# EAGLE schematic Wallboxsteuerung-WEMOS-14062021 (EAGLE 7.5.0)
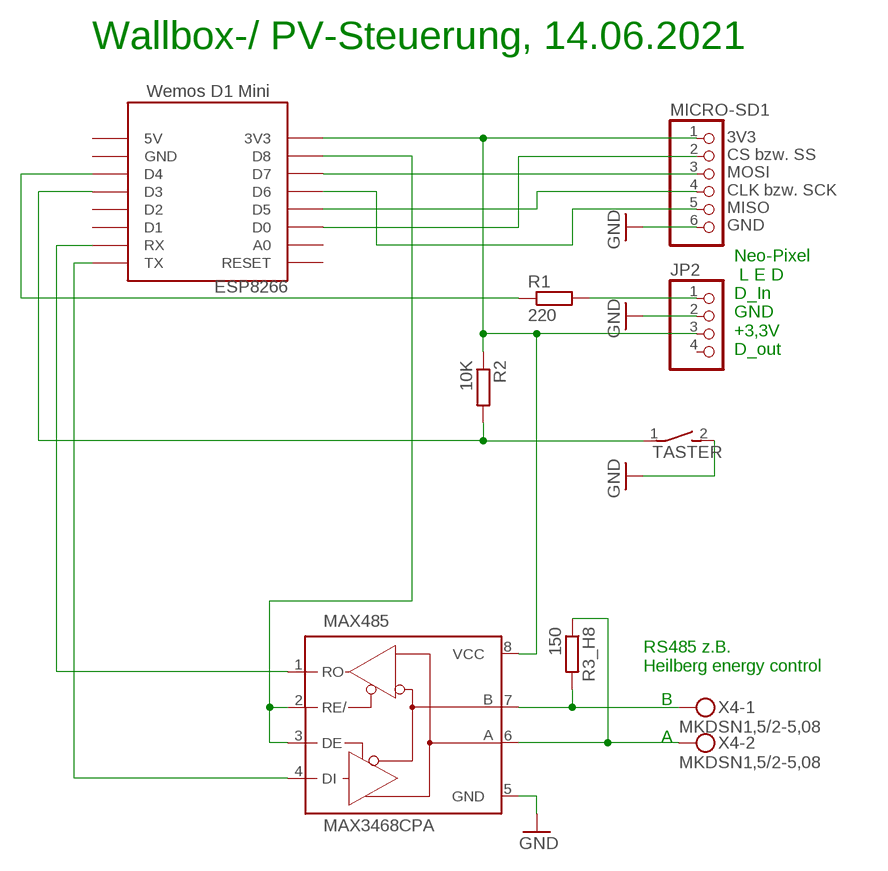
[diagram p0: schematic, sheet 1]

## Parts
ESP8266  Wemos D1 Mini  WEMOS-D1-MINI  [WEMOS-D1-MINI]
JP2  PINHD-1X4  [1X04]
MAX485  MAX3468CPA  [DIL08]
MICRO-SD1  PINHD-1X6  [1X06]
R1  220  R-EU_0309/V  [0309V]
R2  10K  R-EU_0309/V  [0309V]
R3_H8  150  R-EU_0309/V  [0309V]
TASTER  DS01E  [DS-01]
X4  MKDSN1,5/2-5,08  [MKDSN1,5/2-5,08]

## Nets
GND: JP2.2 MAX485.5(GND) MICRO-SD1.6 TASTER.2
N$1: ESP8266.D4 R1.1
N$37: ESP8266.3V3 JP2.3 MAX485.8(VCC) MICRO-SD1.1 R2.1
N$39: JP2.1 R1.2
N$40: ESP8266.D3 R2.2 TASTER.1
N$42: ESP8266.D0 MICRO-SD1.2
N$43: ESP8266.D7 MICRO-SD1.3
N$44: ESP8266.D5 MICRO-SD1.4
N$45: ESP8266.D6 MICRO-SD1.5
N$46: MAX485.7(B) R3_H8.2 X4.1
N$47: MAX485.6(A) R3_H8.1 X4.2
N$49: ESP8266.RX MAX485.1(RO)
N$50: ESP8266.TX MAX485.4(DI)
N$51: ESP8266.D8 MAX485.2(RE/) MAX485.3(DE)
Unconnected: ESP8266.5V ESP8266.A0 ESP8266.D1 ESP8266.D2 ESP8266.GND ESP8266.RESET JP2.4

## Notes on the sheet
- Wallbox-/ PV-Steuerung, 14.06.2021
- 3V3
  CS bzw. SS
  MOSI
  CLK bzw. SCK
  MISO
  GND
- Neo-Pixel
   L E D
  D_In
  GND
  +3,3V
  D_out
- RS485 z.B. 
  Heilberg energy control
- B
  
  A

## Library data of the parts
ESP8266 = uwe_esp8266modules1:WEMOS-D1-MINI: WeMos.cc D1 mini ESP8266 module
JP2 = pinhead:PINHD-1X4: PIN HEADER
MAX485 = maxim:MAX34*: +5V, Fail-Safe, 40Mbps, Profibus RS-485/RS-422 Transceivers Source: MAX3465-MAX3469.pdf; OC_FARNELL: unknown; OC_NEWARK: unknown
MICRO-SD1 = pinhead:PINHD-1X6: PIN HEADER
R1 R2 R3_H8 = rcl:R-EU_: RESISTOR, European symbol
TASTER = switch-dil:DS01E: DIL/CODE SWITCH; OC_FARNELL: unknown; OC_NEWARK: unknown
X4 = con-phoenix-508:MKDSN1,5/2-5,08: MKDSN 1,5/ 2-5,08 Printklemme Nennstrom: 13,5 A Nennspannung: 250 V Rastermaß: 5,08 mm Polzahl: 2 Anschlussart: Schraubanschluss Montage: Löten Anschlussrichtung Leiter/Platine: 0 ° Artikelnummer: 1729128 Source: http://eshop.phoenixcontact.com .. 1729128.pdf